# Altium schematic sheet mx8m_power.SchDoc
size A2; SheetNumber: 4; SheetTotal: 15
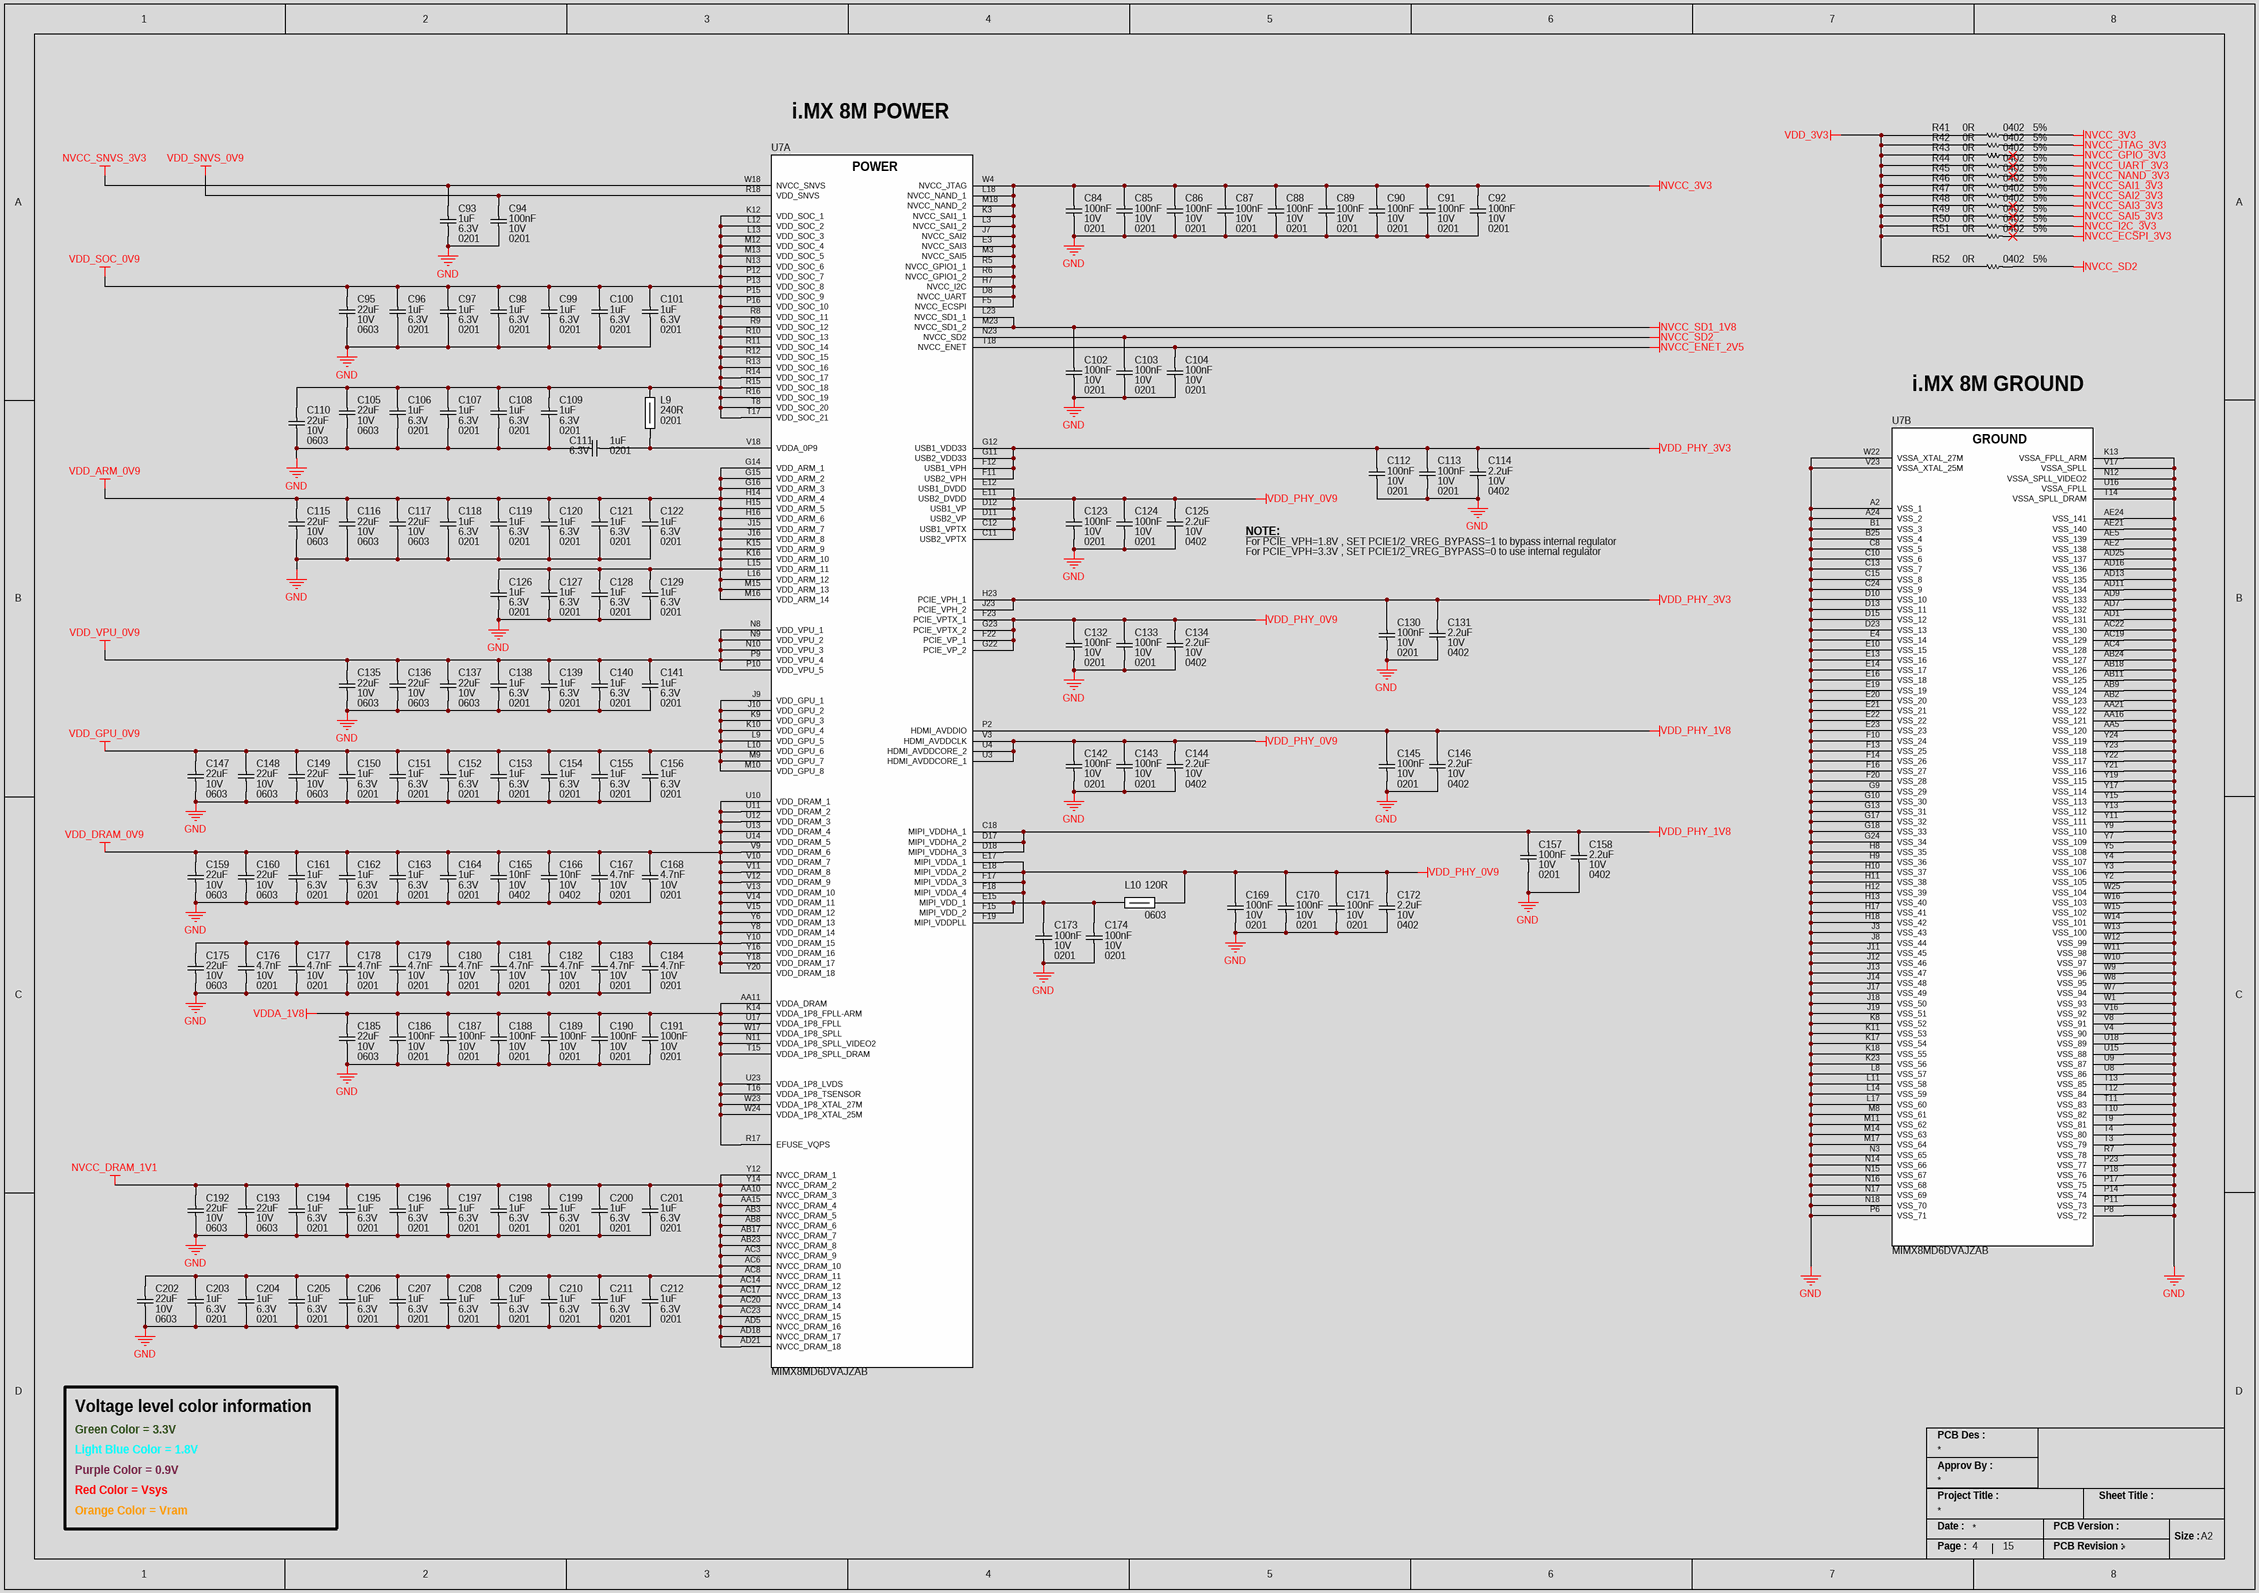
[diagram p0: mx8m_power.SchDoc]

## Parts
C84  Capacitance: 100nF  Voltage Rating: 10V  Case/Package: 0201  [CAP_0201_CAPC0603X03N]  (hidden comment: 0201X104K100CT)
C85  Capacitance: 100nF  Voltage Rating: 10V  Case/Package: 0201  [CAP_0201_CAPC0603X03N]  (hidden comment: 0201X104K100CT)
C86  Capacitance: 100nF  Voltage Rating: 10V  Case/Package: 0201  [CAP_0201_CAPC0603X03N]  (hidden comment: 0201X104K100CT)
C87  Capacitance: 100nF  Voltage Rating: 10V  Case/Package: 0201  [CAP_0201_CAPC0603X03N]  (hidden comment: 0201X104K100CT)
C88  Capacitance: 100nF  Voltage Rating: 10V  Case/Package: 0201  [CAP_0201_CAPC0603X03N]  (hidden comment: 0201X104K100CT)
C89  Capacitance: 100nF  Voltage Rating: 10V  Case/Package: 0201  [CAP_0201_CAPC0603X03N]  (hidden comment: 0201X104K100CT)
C90  Capacitance: 100nF  Voltage Rating: 10V  Case/Package: 0201  [CAP_0201_CAPC0603X03N]  (hidden comment: 0201X104K100CT)
C91  Capacitance: 100nF  Voltage Rating: 10V  Case/Package: 0201  [CAP_0201_CAPC0603X03N]  (hidden comment: 0201X104K100CT)
C92  Capacitance: 100nF  Voltage Rating: 10V  Case/Package: 0201  [CAP_0201_CAPC0603X03N]  (hidden comment: 0201X104K100CT)
C93  Voltage Rating (DC): 6.3V  Capacitance: 1uF  Case/Package: 0201  [CAP_0201_CAPC0603X03N]  (hidden comment: 02016D105MAT2A)
C94  Capacitance: 100nF  Voltage Rating: 10V  Case/Package: 0201  [CAP_0201_CAPC0603X03N]  (hidden comment: 0201X104K100CT)
C95  Capacitance: 22uF  Voltage Rating: 10V  Case Code (Imperial): 0603  [CAP_0603_CAPC1608X08N]  (hidden comment: C1608X5R1A226M080AC)
C96  Voltage Rating (DC): 6.3V  Capacitance: 1uF  Case/Package: 0201  [CAP_0201_CAPC0603X03N]  (hidden comment: 02016D105MAT2A)
C97  Voltage Rating (DC): 6.3V  Capacitance: 1uF  Case/Package: 0201  [CAP_0201_CAPC0603X03N]  (hidden comment: 02016D105MAT2A)
C98  Voltage Rating (DC): 6.3V  Capacitance: 1uF  Case/Package: 0201  [CAP_0201_CAPC0603X03N]  (hidden comment: 02016D105MAT2A)
C99  Voltage Rating (DC): 6.3V  Capacitance: 1uF  Case/Package: 0201  [CAP_0201_CAPC0603X03N]  (hidden comment: 02016D105MAT2A)
C100  Voltage Rating (DC): 6.3V  Capacitance: 1uF  Case/Package: 0201  [CAP_0201_CAPC0603X03N]  (hidden comment: 02016D105MAT2A)
C101  Voltage Rating (DC): 6.3V  Capacitance: 1uF  Case/Package: 0201  [CAP_0201_CAPC0603X03N]  (hidden comment: 02016D105MAT2A)
C102  Capacitance: 100nF  Voltage Rating: 10V  Case/Package: 0201  [CAP_0201_CAPC0603X03N]  (hidden comment: 0201X104K100CT)
C103  Capacitance: 100nF  Voltage Rating: 10V  Case/Package: 0201  [CAP_0201_CAPC0603X03N]  (hidden comment: 0201X104K100CT)
C104  Capacitance: 100nF  Voltage Rating: 10V  Case/Package: 0201  [CAP_0201_CAPC0603X03N]  (hidden comment: 0201X104K100CT)
C105  Capacitance: 22uF  Voltage Rating: 10V  Case Code (Imperial): 0603  [CAP_0603_CAPC1608X08N]  (hidden comment: C1608X5R1A226M080AC)
C106  Voltage Rating (DC): 6.3V  Capacitance: 1uF  Case/Package: 0201  [CAP_0201_CAPC0603X03N]  (hidden comment: 02016D105MAT2A)
C107  Voltage Rating (DC): 6.3V  Capacitance: 1uF  Case/Package: 0201  [CAP_0201_CAPC0603X03N]  (hidden comment: 02016D105MAT2A)
C108  Voltage Rating (DC): 6.3V  Capacitance: 1uF  Case/Package: 0201  [CAP_0201_CAPC0603X03N]  (hidden comment: 02016D105MAT2A)
C109  Voltage Rating (DC): 6.3V  Capacitance: 1uF  Case/Package: 0201  [CAP_0201_CAPC0603X03N]  (hidden comment: 02016D105MAT2A)
C110  Capacitance: 22uF  Voltage Rating: 10V  Case Code (Imperial): 0603  [CAP_0603_CAPC1608X08N]  (hidden comment: C1608X5R1A226M080AC)
C111  Voltage Rating (DC): 6.3V  Capacitance: 1uF  Case/Package: 0201  [CAP_0201_CAPC0603X03N]  (hidden comment: 02016D105MAT2A)
C112  Capacitance: 100nF  Voltage Rating: 10V  Case/Package: 0201  [CAP_0201_CAPC0603X03N]  (hidden comment: 0201X104K100CT)
C113  Capacitance: 100nF  Voltage Rating: 10V  Case/Package: 0201  [CAP_0201_CAPC0603X03N]  (hidden comment: 0201X104K100CT)
C114  Voltage Rating (DC): 10V  Capacitance: 2.2uF  Case/Package: 0402  [CAP_0201_CAPC0603X03N]  (hidden comment: C1005X5R1A225K050BC)
C115  Capacitance: 22uF  Voltage Rating: 10V  Case Code (Imperial): 0603  [CAP_0603_CAPC1608X08N]  (hidden comment: C1608X5R1A226M080AC)
C116  Capacitance: 22uF  Voltage Rating: 10V  Case Code (Imperial): 0603  [CAP_0603_CAPC1608X08N]  (hidden comment: C1608X5R1A226M080AC)
C117  Capacitance: 22uF  Voltage Rating: 10V  Case Code (Imperial): 0603  [CAP_0603_CAPC1608X08N]  (hidden comment: C1608X5R1A226M080AC)
C118  Voltage Rating (DC): 6.3V  Capacitance: 1uF  Case/Package: 0201  [CAP_0201_CAPC0603X03N]  (hidden comment: 02016D105MAT2A)
C119  Voltage Rating (DC): 6.3V  Capacitance: 1uF  Case/Package: 0201  [CAP_0201_CAPC0603X03N]  (hidden comment: 02016D105MAT2A)
C120  Voltage Rating (DC): 6.3V  Capacitance: 1uF  Case/Package: 0201  [CAP_0201_CAPC0603X03N]  (hidden comment: 02016D105MAT2A)
C121  Voltage Rating (DC): 6.3V  Capacitance: 1uF  Case/Package: 0201  [CAP_0201_CAPC0603X03N]  (hidden comment: 02016D105MAT2A)
C122  Voltage Rating (DC): 6.3V  Capacitance: 1uF  Case/Package: 0201  [CAP_0201_CAPC0603X03N]  (hidden comment: 02016D105MAT2A)
C123  Capacitance: 100nF  Voltage Rating: 10V  Case/Package: 0201  [CAP_0201_CAPC0603X03N]  (hidden comment: 0201X104K100CT)
C124  Capacitance: 100nF  Voltage Rating: 10V  Case/Package: 0201  [CAP_0201_CAPC0603X03N]  (hidden comment: 0201X104K100CT)
C125  Voltage Rating (DC): 10V  Capacitance: 2.2uF  Case/Package: 0402  [CAP_0201_CAPC0603X03N]  (hidden comment: C1005X5R1A225K050BC)
C126  Voltage Rating (DC): 6.3V  Capacitance: 1uF  Case/Package: 0201  [CAP_0201_CAPC0603X03N]  (hidden comment: 02016D105MAT2A)
C127  Voltage Rating (DC): 6.3V  Capacitance: 1uF  Case/Package: 0201  [CAP_0201_CAPC0603X03N]  (hidden comment: 02016D105MAT2A)
C128  Voltage Rating (DC): 6.3V  Capacitance: 1uF  Case/Package: 0201  [CAP_0201_CAPC0603X03N]  (hidden comment: 02016D105MAT2A)
C129  Voltage Rating (DC): 6.3V  Capacitance: 1uF  Case/Package: 0201  [CAP_0201_CAPC0603X03N]  (hidden comment: 02016D105MAT2A)
C130  Capacitance: 100nF  Voltage Rating: 10V  Case/Package: 0201  [CAP_0201_CAPC0603X03N]  (hidden comment: 0201X104K100CT)
C131  Voltage Rating (DC): 10V  Capacitance: 2.2uF  Case/Package: 0402  [CAP_0201_CAPC0603X03N]  (hidden comment: C1005X5R1A225K050BC)
C132  Capacitance: 100nF  Voltage Rating: 10V  Case/Package: 0201  [CAP_0201_CAPC0603X03N]  (hidden comment: 0201X104K100CT)
C133  Capacitance: 100nF  Voltage Rating: 10V  Case/Package: 0201  [CAP_0201_CAPC0603X03N]  (hidden comment: 0201X104K100CT)
C134  Voltage Rating (DC): 10V  Capacitance: 2.2uF  Case/Package: 0402  [CAP_0201_CAPC0603X03N]  (hidden comment: C1005X5R1A225K050BC)
C135  Capacitance: 22uF  Voltage Rating: 10V  Case Code (Imperial): 0603  [CAP_0603_CAPC1608X08N]  (hidden comment: C1608X5R1A226M080AC)
C136  Capacitance: 22uF  Voltage Rating: 10V  Case Code (Imperial): 0603  [CAP_0603_CAPC1608X08N]  (hidden comment: C1608X5R1A226M080AC)
C137  Capacitance: 22uF  Voltage Rating: 10V  Case Code (Imperial): 0603  [CAP_0603_CAPC1608X08N]  (hidden comment: C1608X5R1A226M080AC)
C138  Voltage Rating (DC): 6.3V  Capacitance: 1uF  Case/Package: 0201  [CAP_0201_CAPC0603X03N]  (hidden comment: 02016D105MAT2A)
C139  Voltage Rating (DC): 6.3V  Capacitance: 1uF  Case/Package: 0201  [CAP_0201_CAPC0603X03N]  (hidden comment: 02016D105MAT2A)
C140  Voltage Rating (DC): 6.3V  Capacitance: 1uF  Case/Package: 0201  [CAP_0201_CAPC0603X03N]  (hidden comment: 02016D105MAT2A)
C141  Voltage Rating (DC): 6.3V  Capacitance: 1uF  Case/Package: 0201  [CAP_0201_CAPC0603X03N]  (hidden comment: 02016D105MAT2A)
C142  Capacitance: 100nF  Voltage Rating: 10V  Case/Package: 0201  [CAP_0201_CAPC0603X03N]  (hidden comment: 0201X104K100CT)
C143  Capacitance: 100nF  Voltage Rating: 10V  Case/Package: 0201  [CAP_0201_CAPC0603X03N]  (hidden comment: 0201X104K100CT)
C144  Voltage Rating (DC): 10V  Capacitance: 2.2uF  Case/Package: 0402  [CAP_0201_CAPC0603X03N]  (hidden comment: C1005X5R1A225K050BC)
C145  Capacitance: 100nF  Voltage Rating: 10V  Case/Package: 0201  [CAP_0201_CAPC0603X03N]  (hidden comment: 0201X104K100CT)
C146  Voltage Rating (DC): 10V  Capacitance: 2.2uF  Case/Package: 0402  [CAP_0201_CAPC0603X03N]  (hidden comment: C1005X5R1A225K050BC)
C147  Capacitance: 22uF  Voltage Rating: 10V  Case Code (Imperial): 0603  [CAP_0603_CAPC1608X08N]  (hidden comment: C1608X5R1A226M080AC)
C148  Capacitance: 22uF  Voltage Rating: 10V  Case Code (Imperial): 0603  [CAP_0603_CAPC1608X08N]  (hidden comment: C1608X5R1A226M080AC)
C149  Capacitance: 22uF  Voltage Rating: 10V  Case Code (Imperial): 0603  [CAP_0603_CAPC1608X08N]  (hidden comment: C1608X5R1A226M080AC)
C150  Voltage Rating (DC): 6.3V  Capacitance: 1uF  Case/Package: 0201  [CAP_0201_CAPC0603X03N]  (hidden comment: 02016D105MAT2A)
C151  Voltage Rating (DC): 6.3V  Capacitance: 1uF  Case/Package: 0201  [CAP_0201_CAPC0603X03N]  (hidden comment: 02016D105MAT2A)
C152  Voltage Rating (DC): 6.3V  Capacitance: 1uF  Case/Package: 0201  [CAP_0201_CAPC0603X03N]  (hidden comment: 02016D105MAT2A)
C153  Voltage Rating (DC): 6.3V  Capacitance: 1uF  Case/Package: 0201  [CAP_0201_CAPC0603X03N]  (hidden comment: 02016D105MAT2A)
C154  Voltage Rating (DC): 6.3V  Capacitance: 1uF  Case/Package: 0201  [CAP_0201_CAPC0603X03N]  (hidden comment: 02016D105MAT2A)
C155  Voltage Rating (DC): 6.3V  Capacitance: 1uF  Case/Package: 0201  [CAP_0201_CAPC0603X03N]  (hidden comment: 02016D105MAT2A)
C156  Voltage Rating (DC): 6.3V  Capacitance: 1uF  Case/Package: 0201  [CAP_0201_CAPC0603X03N]  (hidden comment: 02016D105MAT2A)
C157  Capacitance: 100nF  Voltage Rating: 10V  Case/Package: 0201  [CAP_0201_CAPC0603X03N]  (hidden comment: 0201X104K100CT)
C158  Voltage Rating (DC): 10V  Capacitance: 2.2uF  Case/Package: 0402  [CAP_0201_CAPC0603X03N]  (hidden comment: C1005X5R1A225K050BC)
C159  Capacitance: 22uF  Voltage Rating: 10V  Case Code (Imperial): 0603  [CAP_0603_CAPC1608X08N]  (hidden comment: C1608X5R1A226M080AC)
C160  Capacitance: 22uF  Voltage Rating: 10V  Case Code (Imperial): 0603  [CAP_0603_CAPC1608X08N]  (hidden comment: C1608X5R1A226M080AC)
C161  Voltage Rating (DC): 6.3V  Capacitance: 1uF  Case/Package: 0201  [CAP_0201_CAPC0603X03N]  (hidden comment: 02016D105MAT2A)
C162  Voltage Rating (DC): 6.3V  Capacitance: 1uF  Case/Package: 0201  [CAP_0201_CAPC0603X03N]  (hidden comment: 02016D105MAT2A)
C163  Voltage Rating (DC): 6.3V  Capacitance: 1uF  Case/Package: 0201  [CAP_0201_CAPC0603X03N]  (hidden comment: 02016D105MAT2A)
C164  Voltage Rating (DC): 6.3V  Capacitance: 1uF  Case/Package: 0201  [CAP_0201_CAPC0603X03N]  (hidden comment: 02016D105MAT2A)
C165  Case Code (Imperial): 0402  Voltage Rating: 10V  Capacitance: 10nF  [CAP_0402_CAPC1005X05N]  (hidden comment: C0402C103K8RACTU)
C166  Case Code (Imperial): 0402  Voltage Rating: 10V  Capacitance: 10nF  [CAP_0402_CAPC1005X05N]  (hidden comment: C0402C103K8RACTU)
C167  Voltage Rating: 10V  Capacitance: 4.7nF  Case/Package: 0201  [CAP_0201_CAPC0603X03N]  (hidden comment: GRM033R61A472KA01D)
C168  Voltage Rating: 10V  Capacitance: 4.7nF  Case/Package: 0201  [CAP_0201_CAPC0603X03N]  (hidden comment: GRM033R61A472KA01D)
C169  Capacitance: 100nF  Voltage Rating: 10V  Case/Package: 0201  [CAP_0201_CAPC0603X03N]  (hidden comment: 0201X104K100CT)
C170  Capacitance: 100nF  Voltage Rating: 10V  Case/Package: 0201  [CAP_0201_CAPC0603X03N]  (hidden comment: 0201X104K100CT)
C171  Capacitance: 100nF  Voltage Rating: 10V  Case/Package: 0201  [CAP_0201_CAPC0603X03N]  (hidden comment: 0201X104K100CT)
C172  Voltage Rating (DC): 10V  Capacitance: 2.2uF  Case/Package: 0402  [CAP_0201_CAPC0603X03N]  (hidden comment: C1005X5R1A225K050BC)
C173  Capacitance: 100nF  Voltage Rating: 10V  Case/Package: 0201  [CAP_0201_CAPC0603X03N]  (hidden comment: 0201X104K100CT)
C174  Capacitance: 100nF  Voltage Rating: 10V  Case/Package: 0201  [CAP_0201_CAPC0603X03N]  (hidden comment: 0201X104K100CT)
C175  Capacitance: 22uF  Voltage Rating: 10V  Case Code (Imperial): 0603  [CAP_0603_CAPC1608X08N]  (hidden comment: C1608X5R1A226M080AC)
C176  Voltage Rating: 10V  Capacitance: 4.7nF  Case/Package: 0201  [CAP_0201_CAPC0603X03N]  (hidden comment: GRM033R61A472KA01D)
C177  Voltage Rating: 10V  Capacitance: 4.7nF  Case/Package: 0201  [CAP_0201_CAPC0603X03N]  (hidden comment: GRM033R61A472KA01D)
C178  Voltage Rating: 10V  Capacitance: 4.7nF  Case/Package: 0201  [CAP_0201_CAPC0603X03N]  (hidden comment: GRM033R61A472KA01D)
C179  Voltage Rating: 10V  Capacitance: 4.7nF  Case/Package: 0201  [CAP_0201_CAPC0603X03N]  (hidden comment: GRM033R61A472KA01D)
C180  Voltage Rating: 10V  Capacitance: 4.7nF  Case/Package: 0201  [CAP_0201_CAPC0603X03N]  (hidden comment: GRM033R61A472KA01D)
C181  Voltage Rating: 10V  Capacitance: 4.7nF  Case/Package: 0201  [CAP_0201_CAPC0603X03N]  (hidden comment: GRM033R61A472KA01D)
C182  Voltage Rating: 10V  Capacitance: 4.7nF  Case/Package: 0201  [CAP_0201_CAPC0603X03N]  (hidden comment: GRM033R61A472KA01D)
C183  Voltage Rating: 10V  Capacitance: 4.7nF  Case/Package: 0201  [CAP_0201_CAPC0603X03N]  (hidden comment: GRM033R61A472KA01D)
C184  Voltage Rating: 10V  Capacitance: 4.7nF  Case/Package: 0201  [CAP_0201_CAPC0603X03N]  (hidden comment: GRM033R61A472KA01D)
C185  Capacitance: 22uF  Voltage Rating: 10V  Case Code (Imperial): 0603  [CAP_0603_CAPC1608X08N]  (hidden comment: C1608X5R1A226M080AC)
C186  Capacitance: 100nF  Voltage Rating: 10V  Case/Package: 0201  [CAP_0201_CAPC0603X03N]  (hidden comment: 0201X104K100CT)
C187  Capacitance: 100nF  Voltage Rating: 10V  Case/Package: 0201  [CAP_0201_CAPC0603X03N]  (hidden comment: 0201X104K100CT)
C188  Capacitance: 100nF  Voltage Rating: 10V  Case/Package: 0201  [CAP_0201_CAPC0603X03N]  (hidden comment: 0201X104K100CT)
C189  Capacitance: 100nF  Voltage Rating: 10V  Case/Package: 0201  [CAP_0201_CAPC0603X03N]  (hidden comment: 0201X104K100CT)
C190  Capacitance: 100nF  Voltage Rating: 10V  Case/Package: 0201  [CAP_0201_CAPC0603X03N]  (hidden comment: 0201X104K100CT)
C191  Capacitance: 100nF  Voltage Rating: 10V  Case/Package: 0201  [CAP_0201_CAPC0603X03N]  (hidden comment: 0201X104K100CT)
C192  Capacitance: 22uF  Voltage Rating: 10V  Case Code (Imperial): 0603  [CAP_0603_CAPC1608X08N]  (hidden comment: C1608X5R1A226M080AC)
C193  Capacitance: 22uF  Voltage Rating: 10V  Case Code (Imperial): 0603  [CAP_0603_CAPC1608X08N]  (hidden comment: C1608X5R1A226M080AC)
C194  Voltage Rating (DC): 6.3V  Capacitance: 1uF  Case/Package: 0201  [CAP_0201_CAPC0603X03N]  (hidden comment: 02016D105MAT2A)
C195  Voltage Rating (DC): 6.3V  Capacitance: 1uF  Case/Package: 0201  [CAP_0201_CAPC0603X03N]  (hidden comment: 02016D105MAT2A)
C196  Voltage Rating (DC): 6.3V  Capacitance: 1uF  Case/Package: 0201  [CAP_0201_CAPC0603X03N]  (hidden comment: 02016D105MAT2A)
C197  Voltage Rating (DC): 6.3V  Capacitance: 1uF  Case/Package: 0201  [CAP_0201_CAPC0603X03N]  (hidden comment: 02016D105MAT2A)
C198  Voltage Rating (DC): 6.3V  Capacitance: 1uF  Case/Package: 0201  [CAP_0201_CAPC0603X03N]  (hidden comment: 02016D105MAT2A)
C199  Voltage Rating (DC): 6.3V  Capacitance: 1uF  Case/Package: 0201  [CAP_0201_CAPC0603X03N]  (hidden comment: 02016D105MAT2A)
C200  Voltage Rating (DC): 6.3V  Capacitance: 1uF  Case/Package: 0201  [CAP_0201_CAPC0603X03N]  (hidden comment: 02016D105MAT2A)
C201  Voltage Rating (DC): 6.3V  Capacitance: 1uF  Case/Package: 0201  [CAP_0201_CAPC0603X03N]  (hidden comment: 02016D105MAT2A)
C202  Capacitance: 22uF  Voltage Rating: 10V  Case Code (Imperial): 0603  [CAP_0603_CAPC1608X08N]  (hidden comment: C1608X5R1A226M080AC)
C203  Voltage Rating (DC): 6.3V  Capacitance: 1uF  Case/Package: 0201  [CAP_0201_CAPC0603X03N]  (hidden comment: 02016D105MAT2A)
C204  Voltage Rating (DC): 6.3V  Capacitance: 1uF  Case/Package: 0201  [CAP_0201_CAPC0603X03N]  (hidden comment: 02016D105MAT2A)
C205  Voltage Rating (DC): 6.3V  Capacitance: 1uF  Case/Package: 0201  [CAP_0201_CAPC0603X03N]  (hidden comment: 02016D105MAT2A)
C206  Voltage Rating (DC): 6.3V  Capacitance: 1uF  Case/Package: 0201  [CAP_0201_CAPC0603X03N]  (hidden comment: 02016D105MAT2A)
C207  Voltage Rating (DC): 6.3V  Capacitance: 1uF  Case/Package: 0201  [CAP_0201_CAPC0603X03N]  (hidden comment: 02016D105MAT2A)
C208  Voltage Rating (DC): 6.3V  Capacitance: 1uF  Case/Package: 0201  [CAP_0201_CAPC0603X03N]  (hidden comment: 02016D105MAT2A)
C209  Voltage Rating (DC): 6.3V  Capacitance: 1uF  Case/Package: 0201  [CAP_0201_CAPC0603X03N]  (hidden comment: 02016D105MAT2A)
C210  Voltage Rating (DC): 6.3V  Capacitance: 1uF  Case/Package: 0201  [CAP_0201_CAPC0603X03N]  (hidden comment: 02016D105MAT2A)
C211  Voltage Rating (DC): 6.3V  Capacitance: 1uF  Case/Package: 0201  [CAP_0201_CAPC0603X03N]  (hidden comment: 02016D105MAT2A)
C212  Voltage Rating (DC): 6.3V  Capacitance: 1uF  Case/Package: 0201  [CAP_0201_CAPC0603X03N]  (hidden comment: 02016D105MAT2A)
L9  Impedance: 240R  Case/Package: 0201  [IND_0201_FERRITE_BEAD]  (hidden comment: BLM03AX241SN1D)
L10  Impedance: 120R  Case/Package: 0603  [IND_0603_INDC1608X08N]  (hidden comment: BLM18PG121SH1D)
R41  Case Code (Imperial): 0402  Tolerance: 5%  Resistance: 0R  [RES_0402_RESC1005X04N]  (hidden comment: ERJ-2GE0R00X)
R42  Case Code (Imperial): 0402  Tolerance: 5%  Resistance: 0R  [RES_0402_RESC1005X04N]  (hidden comment: ERJ-2GE0R00X)
R43  Case Code (Imperial): 0402  Tolerance: 5%  Resistance: 0R  [RES_0402_RESC1005X04N]  (hidden comment: ERJ-2GE0R00X)
R44  Case Code (Imperial): 0402  Tolerance: 5%  Resistance: 0R  [RES_0402_RESC1005X04N]  (hidden comment: ERJ-2GE0R00X)
R45  Case Code (Imperial): 0402  Tolerance: 5%  Resistance: 0R  [RES_0402_RESC1005X04N]  (hidden comment: ERJ-2GE0R00X)
R46  Case Code (Imperial): 0402  Tolerance: 5%  Resistance: 0R  [RES_0402_RESC1005X04N]  (hidden comment: ERJ-2GE0R00X)
R47  Case Code (Imperial): 0402  Tolerance: 5%  Resistance: 0R  [RES_0402_RESC1005X04N]  (hidden comment: ERJ-2GE0R00X)
R48  Case Code (Imperial): 0402  Tolerance: 5%  Resistance: 0R  [RES_0402_RESC1005X04N]  (hidden comment: ERJ-2GE0R00X)
R49  Case Code (Imperial): 0402  Tolerance: 5%  Resistance: 0R  [RES_0402_RESC1005X04N]  (hidden comment: ERJ-2GE0R00X)
R50  Case Code (Imperial): 0402  Tolerance: 5%  Resistance: 0R  [RES_0402_RESC1005X04N]  (hidden comment: ERJ-2GE0R00X)
R51  Case Code (Imperial): 0402  Tolerance: 5%  Resistance: 0R  [RES_0402_RESC1005X04N]  (hidden comment: ERJ-2GE0R00X)
R52  Case Code (Imperial): 0402  Tolerance: 5%  Resistance: 0R  [RES_0402_RESC1005X04N]  (hidden comment: ERJ-2GE0R00X)
U7  MIMX8MD6DVAJZAB  [IC_MPU_BGA621C65P25X25_1700X1700X218]  (parts A,B of 14)

## Nets
GND: C84.1 C85.1 C86.1 C87.1 C88.1 C89.1 C90.1 C91.1 C92.1 C93.1 C94.1 C95.1 C96.1 C97.1 C98.1 C99.1 C100.1 C101.1 C102.1 C103.1 C104.1 C105.1 C106.1 C107.1 C108.1 C109.1 C110.1 C111.2 C112.1 C113.1 C114.1 C115.1 C116.1 C117.1 C118.1 C119.1 C120.1 C121.1 C122.1 C123.1 C124.1 C125.1 C126.1 C127.1 C128.1 C129.1 C130.1 C131.1 C132.1 C133.1 C134.1 C135.1 C136.1 C137.1 C138.1 C139.1 C140.1 C141.1 C142.1 C143.1 C144.1 C145.1 C146.1 C147.1 C148.1 C149.1 C150.1 C151.1 C152.1 C153.1 C154.1 C155.1 C156.1 C157.1 C158.1 C159.1 C160.1 C161.1 C162.1 C163.1 C164.1 C165.1 C166.1 C167.1 C168.1 C169.1 C170.1 C171.1 C172.1 C173.1 C174.1 C175.1 C176.1 C177.1 C178.1 C179.1 C180.1 C181.1 C182.1 C183.1 C184.1 C185.1 C186.1 C187.1 C188.1 C189.1 C190.1 C191.1 C192.1 C193.1 C194.1 C195.1 C196.1 C197.1 C198.1 C199.1 C200.1 C201.1 C202.1 C203.1 C204.1 C205.1 C206.1 C207.1 C208.1 C209.1 C210.1 C211.1 C212.1 U7.A2(VSS_1) U7.A24(VSS_2) U7.AA5(VSS_120) U7.AA16(VSS_121) U7.AA21(VSS_122) U7.AB2(VSS_123) U7.AB9(VSS_124) U7.AB11(VSS_125) U7.AB18(VSS_126) U7.AB24(VSS_127) U7.AC4(VSS_128) U7.AC19(VSS_129) U7.AC22(VSS_130) U7.AD1(VSS_131) U7.AD7(VSS_132) U7.AD9(VSS_133) U7.AD11(VSS_134) U7.AD13(VSS_135) U7.AD16(VSS_136) U7.AD25(VSS_137) U7.AE2(VSS_138) U7.AE5(VSS_139) U7.AE21(VSS_140) U7.AE24(VSS_141) U7.B1(VSS_3) U7.B25(VSS_4) U7.C8(VSS_5) U7.C10(VSS_6) U7.C13(VSS_7) U7.C15(VSS_8) U7.C24(VSS_9) U7.D10(VSS_10) U7.D13(VSS_11) U7.D15(VSS_12) U7.D23(VSS_13) U7.E4(VSS_14) U7.E10(VSS_15) U7.E13(VSS_16) U7.E14(VSS_17) U7.E16(VSS_18) U7.E19(VSS_19) U7.E20(VSS_20) U7.E21(VSS_21) U7.E22(VSS_22) U7.E23(VSS_23) U7.F10(VSS_24) U7.F13(VSS_25) U7.F14(VSS_26) U7.F16(VSS_27) U7.F20(VSS_28) U7.G9(VSS_29) U7.G10(VSS_30) U7.G13(VSS_31) U7.G17(VSS_32) U7.G18(VSS_33) U7.G24(VSS_34) U7.H8(VSS_35) U7.H9(VSS_36) U7.H10(VSS_37) U7.H11(VSS_38) U7.H12(VSS_39) U7.H13(VSS_40) U7.H17(VSS_41) U7.H18(VSS_42) U7.J3(VSS_43) U7.J8(VSS_44) U7.J11(VSS_45) U7.J12(VSS_46) U7.J13(VSS_47) U7.J14(VSS_48) U7.J17(VSS_49) U7.J18(VSS_50) U7.J19(VSS_51) U7.K8(VSS_52) U7.K11(VSS_53) U7.K13(VSSA_FPLL_ARM) U7.K17(VSS_54) U7.K18(VSS_55) U7.K23(VSS_56) U7.L8(VSS_57) U7.L11(VSS_58) U7.L14(VSS_59) U7.L17(VSS_60) U7.M8(VSS_61) U7.M11(VSS_62) U7.M14(VSS_63) U7.M17(VSS_64) U7.N3(VSS_65) U7.N12(VSSA_SPLL_VIDEO2) U7.N14(VSS_66) U7.N15(VSS_67) U7.N16(VSS_68) U7.N17(VSS_69) U7.N18(VSS_70) U7.P6(VSS_71) U7.P8(VSS_72) U7.P11(VSS_73) U7.P14(VSS_74) U7.P17(VSS_75) U7.P18(VSS_76) U7.P23(VSS_77) U7.R7(VSS_78) U7.T3(VSS_79) U7.T4(VSS_80) U7.T9(VSS_81) U7.T10(VSS_82) U7.T11(VSS_83) U7.T12(VSS_84) U7.T13(VSS_85) U7.T14(VSSA_SPLL_DRAM) U7.U8(VSS_86) U7.U9(VSS_87) U7.U15(VSS_88) U7.U16(VSSA_FPLL) U7.U18(VSS_89) U7.V4(VSS_90) U7.V8(VSS_91) U7.V16(VSS_92) U7.V17(VSSA_SPLL) U7.V23(VSSA_XTAL_25M) U7.W1(VSS_93) U7.W7(VSS_94) U7.W8(VSS_95) U7.W9(VSS_96) U7.W10(VSS_97) U7.W11(VSS_98) U7.W12(VSS_99) U7.W13(VSS_100) U7.W14(VSS_101) U7.W15(VSS_102) U7.W16(VSS_103) U7.W22(VSSA_XTAL_27M) U7.W25(VSS_104) U7.Y2(VSS_105) U7.Y3(VSS_106) U7.Y4(VSS_107) U7.Y5(VSS_108) U7.Y7(VSS_109) U7.Y9(VSS_110) U7.Y11(VSS_111) U7.Y13(VSS_112) U7.Y15(VSS_113) U7.Y17(VSS_114) U7.Y19(VSS_115) U7.Y21(VSS_116) U7.Y22(VSS_117) U7.Y23(VSS_118) U7.Y24(VSS_119)
NVCC_3V3: C84.2 C85.2 C86.2 C87.2 C88.2 C89.2 C90.2 C91.2 C92.2 R41.2 U7.D8(NVCC_UART) U7.E3(NVCC_SAI3) U7.F5(NVCC_ECSPI) U7.H7(NVCC_I2C) U7.J7(NVCC_SAI2) U7.K3(NVCC_SAI1_1) U7.L3(NVCC_SAI1_2) U7.L18(NVCC_NAND_1) U7.M3(NVCC_SAI5) U7.M18(NVCC_NAND_2) U7.R5(NVCC_GPIO1_1) U7.R6(NVCC_GPIO1_2) U7.W4(NVCC_JTAG)
NVCC_DRAM_1V1: C192.2 C193.2 C194.2 C195.2 C196.2 C197.2 C198.2 C199.2 C200.2 C201.2 C202.2 C203.2 C204.2 C205.2 C206.2 C207.2 C208.2 C209.2 C210.2 C211.2 C212.2 U7.AA10(NVCC_DRAM_3) U7.AA15(NVCC_DRAM_4) U7.AB3(NVCC_DRAM_5) U7.AB8(NVCC_DRAM_6) U7.AB17(NVCC_DRAM_7) U7.AB23(NVCC_DRAM_8) U7.AC3(NVCC_DRAM_9) U7.AC6(NVCC_DRAM_10) U7.AC8(NVCC_DRAM_11) U7.AC14(NVCC_DRAM_12) U7.AC17(NVCC_DRAM_13) U7.AC20(NVCC_DRAM_14) U7.AC23(NVCC_DRAM_15) U7.AD5(NVCC_DRAM_16) U7.AD18(NVCC_DRAM_17) U7.AD21(NVCC_DRAM_18) U7.Y12(NVCC_DRAM_1) U7.Y14(NVCC_DRAM_2)
NVCC_ECSPI_3V3: R51.2
NVCC_ENET_2V5: C104.2 U7.T18(NVCC_ENET)
NVCC_GPIO_3V3: R43.2
NVCC_I2C_3V3: R50.2
NVCC_JTAG_3V3: R42.2
NVCC_NAND_3V3: R45.2
NVCC_SAI1_3V3: R46.2
NVCC_SAI2_3V3: R47.2
NVCC_SAI3_3V3: R48.2
NVCC_SAI5_3V3: R49.2
NVCC_SD1_1V8: C102.2 U7.L23(NVCC_SD1_1) U7.M23(NVCC_SD1_2)
NVCC_SD2: C103.2 R52.2 U7.N23(NVCC_SD2)
NVCC_SNVS_3V3: C93.2 U7.W18(NVCC_SNVS)
NVCC_UART_3V3: R44.2
VDD_3V3: R41.1 R42.1 R43.1 R44.1 R45.1 R46.1 R47.1 R48.1 R49.1 R50.1 R51.1 R52.1
VDD_ARM_0V9: C115.2 C116.2 C117.2 C118.2 C119.2 C120.2 C121.2 C122.2 C126.2 C127.2 C128.2 C129.2 U7.G14(VDD_ARM_1) U7.G15(VDD_ARM_2) U7.G16(VDD_ARM_3) U7.H14(VDD_ARM_4) U7.H15(VDD_ARM_5) U7.H16(VDD_ARM_6) U7.J15(VDD_ARM_7) U7.J16(VDD_ARM_8) U7.K15(VDD_ARM_9) U7.K16(VDD_ARM_10) U7.L15(VDD_ARM_11) U7.L16(VDD_ARM_12) U7.M15(VDD_ARM_13) U7.M16(VDD_ARM_14)
VDD_DRAM_0V9: C159.2 C160.2 C161.2 C162.2 C163.2 C164.2 C165.2 C166.2 C167.2 C168.2 C175.2 C176.2 C177.2 C178.2 C179.2 C180.2 C181.2 C182.2 C183.2 C184.2 U7.U10(VDD_DRAM_1) U7.U11(VDD_DRAM_2) U7.U12(VDD_DRAM_3) U7.U13(VDD_DRAM_4) U7.U14(VDD_DRAM_5) U7.V9(VDD_DRAM_6) U7.V10(VDD_DRAM_7) U7.V11(VDD_DRAM_8) U7.V12(VDD_DRAM_9) U7.V13(VDD_DRAM_10) U7.V14(VDD_DRAM_11) U7.V15(VDD_DRAM_12) U7.Y6(VDD_DRAM_13) U7.Y8(VDD_DRAM_14) U7.Y10(VDD_DRAM_15) U7.Y16(VDD_DRAM_16) U7.Y18(VDD_DRAM_17) U7.Y20(VDD_DRAM_18)
VDD_GPU_0V9: C147.2 C148.2 C149.2 C150.2 C151.2 C152.2 C153.2 C154.2 C155.2 C156.2 U7.J9(VDD_GPU_1) U7.J10(VDD_GPU_2) U7.K9(VDD_GPU_3) U7.K10(VDD_GPU_4) U7.L9(VDD_GPU_5) U7.L10(VDD_GPU_6) U7.M9(VDD_GPU_7) U7.M10(VDD_GPU_8)
VDD_PHY_0V9: C123.2 C124.2 C125.2 C132.2 C133.2 C134.2 C142.2 C143.2 C144.2 C169.2 C170.2 C171.2 C172.2 L10.2 U7.C11(USB2_VPTX) U7.C12(USB1_VPTX) U7.D11(USB2_VP) U7.D12(USB1_VP) U7.E11(USB2_DVDD) U7.E12(USB1_DVDD) U7.E17(MIPI_VDDA_1) U7.E18(MIPI_VDDA_2) U7.F17(MIPI_VDDA_3) U7.F18(MIPI_VDDA_4) U7.F19(MIPI_VDDPLL) U7.F22(PCIE_VP_1) U7.F23(PCIE_VPTX_1) U7.G22(PCIE_VP_2) U7.G23(PCIE_VPTX_2) U7.U3(HDMI_AVDDCORE_1) U7.U4(HDMI_AVDDCORE_2) U7.V3(HDMI_AVDDCLK)
VDD_PHY_1V8: C145.2 C146.2 C157.2 C158.2 U7.C18(MIPI_VDDHA_1) U7.D17(MIPI_VDDHA_2) U7.D18(MIPI_VDDHA_3) U7.P2(HDMI_AVDDIO)
VDD_PHY_3V3: C112.2 C113.2 C114.2 C130.2 C131.2 U7.F11(USB2_VPH) U7.F12(USB1_VPH) U7.G11(USB2_VDD33) U7.G12(USB1_VDD33) U7.H23(PCIE_VPH_1) U7.J23(PCIE_VPH_2)
VDD_SNVS_0V9: C94.2 U7.R18(VDD_SNVS)
VDD_SOC_0V9: C95.2 C96.2 C97.2 C98.2 C99.2 C100.2 C101.2 C105.2 C106.2 C107.2 C108.2 C109.2 C110.2 L9.2 U7.K12(VDD_SOC_1) U7.L12(VDD_SOC_2) U7.L13(VDD_SOC_3) U7.M12(VDD_SOC_4) U7.M13(VDD_SOC_5) U7.N13(VDD_SOC_6) U7.P12(VDD_SOC_7) U7.P13(VDD_SOC_8) U7.P15(VDD_SOC_9) U7.P16(VDD_SOC_10) U7.R8(VDD_SOC_11) U7.R9(VDD_SOC_12) U7.R10(VDD_SOC_13) U7.R11(VDD_SOC_14) U7.R12(VDD_SOC_15) U7.R13(VDD_SOC_16) U7.R14(VDD_SOC_17) U7.R15(VDD_SOC_18) U7.R16(VDD_SOC_19) U7.T8(VDD_SOC_20) U7.T17(VDD_SOC_21)
VDD_VPU_0V9: C135.2 C136.2 C137.2 C138.2 C139.2 C140.2 C141.2 U7.N8(VDD_VPU_1) U7.N9(VDD_VPU_2) U7.N10(VDD_VPU_3) U7.P9(VDD_VPU_4) U7.P10(VDD_VPU_5)
VDDA_1V8: C185.2 C186.2 C187.2 C188.2 C189.2 C190.2 C191.2 U7.AA11(VDDA_DRAM) U7.K14(VDDA_1P8_FPLL-ARM) U7.N11(VDDA_1P8_SPLL_VIDEO2) U7.R17(EFUSE_VQPS) U7.T15(VDDA_1P8_SPLL_DRAM) U7.T16(VDDA_1P8_TSENSOR) U7.U17(VDDA_1P8_FPLL) U7.U23(VDDA_1P8_LVDS) U7.W17(VDDA_1P8_SPLL) U7.W23(VDDA_1P8_XTAL_27M) U7.W24(VDDA_1P8_XTAL_25M)
NetC111_1: C111.1 L9.1 U7.V18(VDDA_0P9)
NetC173_2: C173.2 C174.2 L10.1 U7.E15(MIPI_VDD_1) U7.F15(MIPI_VDD_2)

## Notes on the sheet
- i.MX 8M POWER
- i.MX 8M GROUND
- NOTE:
- For PCIE_VPH=1.8V , SET PCIE1/2_VREG_BYPASS=1 to bypass internal regulator
- For PCIE_VPH=3.3V , SET PCIE1/2_VREG_BYPASS=0 to use internal regulator
- Voltage level color information
- Green Color = 3.3V
- Light Blue Color = 1.8V
- Purple Color = 0.9V
- Red Color = Vsys
- Orange Color = Vram
- PCB Des :
- Approv By :
- Project Title :
- Sheet Title :
- Date :
- Page :
- PCB Version :
- PCB Revision :
- Size :
- A2
- (in symbol IC_MPU_ARM_1.5GHZ_MIMX8MD6DVAJZAB, part A) POWER
- (in symbol IC_MPU_ARM_1.5GHZ_MIMX8MD6DVAJZAB, part B) GROUND

## Library data of the parts
C84-C92 C94 C102-C104 C112 C113 C123 C124 C130 C132 C133 C142 C143 C145 C157 C169-C171 C173 C174 C186-C191 = CAP_0.1UF_10V_X5R_0201: 0201 0.1 uF 10 V ±10 %Tolerance X5R Surface Mount Multilayer Ceramic Capacitor; Manufacturer: Walsin Technologies; Tolerance: 10%; Dielectric: 1537DielectricType; Supplier 1: Digi-Key; Manufacturer Part Number: 0201X104K100CT; RoHS: Yes; Category: Ceramic Capacitors; Stock 1: 1142023; Pricing 1: 1=0.1, 10=0.028, 50=0.0164, 100=0.0127, 500=0.00954, 1000=0.0075, 2500=0.00682, 5000=0.00627 (USD); Mount: Surface Mount; Case Code (Imperial): 0201; Case Code (Metric): 0603; Min Operating Temperature: -55°C; Max Operating Temperature: 85°C; Packaging: Cut Tape; Series: -; Voltage Rating (DC): 10V; RoHS Compliant: Yes; Lead Free: 5697LeadFree; ComponentLink1URL: http://www.passivecomponent.com/indexsea/0201X104K100CT-IL.pdf?src-supplier=Digi-Key; ComponentLink1Description: http://www.passivecomponent.com/indexsea/0201X104K100CT-IL.pdf?src-supplier=Digi-Key; ComponentLink2URL: http://www.passivecomponent.com/wp-content/uploads/2018/10/MLCC.pdf?src-supplier=Digi-Key; ComponentLink2Description: http://www.passivecomponent.com/wp-content/uploads/2018/10/MLCC.pdf?src-supplier=Digi-Key; ComponentLink3URL: http://datasheet.octopart.com/0201X104K100CT-Walsin-Technologies-datasheet-136037192.pdf?src-supplier=Rs; ComponentLink3Description: http://datasheet.octopart.com/0201X104K100CT-Walsin-Technologies-datasheet-136037192.pdf?src-supplier=Rs; Supplier Part Number 1: 1292-1160-6-ND
C93 C96-C101 C106-C109 C111 C118-C122 C126-C129 C138-C141 C150-C156 C161-C164 C194-C201 C203-C212 = CAP_1UF_6.3V_X5R_0201: 0201 1 uF 6.3 V ±20 % Tolerance X5R Surface Mount Multilayer Ceramic Capacitor; Manufacturer: Kyocera AVX; Tolerance: 20%; Supplier 1: Mouser; Manufacturer Part Number: 02016D105MAT2A; RoHS: Yes; Category: Ceramic Capacitors; Stock 1: 1026413; Pricing 1: 1=0.1, 10=0.028, 50=0.028, 100=0.014, 1000=0.008, 10000=0.006 (USD); Mount: Surface Mount; Number of Pins: 2; Case Code (Metric): 0603; Case Code (Imperial): 0201; Min Operating Temperature: -55°C; Max Operating Temperature: 85°C; Packaging: Cut Tape; Series: -; Voltage Rating: 6.3V; Package Quantity: 1; Length: 0.024inch; Width: 0.012inch; Thickness: 0.013inch; Depth: 0.3mm; Lead Free: Lead Free; RoHS Compliant: Yes; Reach SVHC Compliant: No; ComponentLink1URL: https://datasheet.ciiva.com/6265/cx5r-6265595.pdf?src-supplier=Digi-Key; ComponentLink1Description: https://datasheet.ciiva.com/6265/cx5r-6265595.pdf?src-supplier=Digi-Key; ComponentLink2URL: https://datasheet.ciiva.com/1123/1666675-1123122.pdf?src-supplier=Element14; ComponentLink2Description: https://datasheet.ciiva.com/1123/1666675-1123122.pdf?src-supplier=Element14; ComponentLink3URL: https://datasheet.ciiva.com/14891/cx5r-14891029.pdf?src-supplier=Digi-Key; ComponentLink3Description: https://datasheet.ciiva.com/14891/cx5r-14891029.pdf?src-supplier=Digi-Key; ComponentLink4URL: https://datasheet.ciiva.com/7614/cx5r-7614682.pdf?src-supplier=Digi-Key; ComponentLink4Description: https://datasheet.ciiva.com/7614/cx5r-7614682.pdf?src-supplier=Digi-Key; ComponentLink5URL: https://datasheet.ciiva.com/14891/cx5r-14891030.pdf?src-supplier=Digi-Key; ComponentLink5Description: https://datasheet.ciiva.com/14891/cx5r-14891030.pdf?src-supplier=Digi-Key; Supplier Part Number 1: 581-02016D105MAT2A; Dielectric: X5R
C95 C105 C110 C115-C117 C135-C137 C147-C149 C159 C160 C175 C185 C192 C193 C202 = CAP_22UF_10V_X5R_0603: Multilayer Ceramic Capacitor, 22 uF, 10 V, ± 20%, X5R, 0603 [1608 Metric]; Manufacturer: TDK; Supplier 1: Digi-Key; Manufacturer Part Number: C1608X5R1A226M080AC; RoHS: Yes; Category: Ceramic Capacitors; Stock 1: 1971709; Pricing 1: 1=0.32, 10=0.208, 50=0.1534, 100=0.1248, 500=0.09856, 1000=0.08323 (USD); Mount: Surface Mount; Case/Package: 0603; Case Code (Metric): 1608; Dielectric Material: Ceramic; Weight: 7.1E-05oz; Min Operating Temperature: -55°C; Max Operating Temperature: 85°C; Tolerance: 20%; Packaging: Tape and Reel; Voltage Rating (DC): 10V; Termination: SMD/SMT; Series: C; Package Quantity: 4000; Dielectric: X5R; Length: 1.6mm; Width: 0.8mm; Height: 0.8mm; Reach SVHC Compliant: No; Lead Free: Lead Free; RoHS Compliant: Yes; ComponentLink1URL: https://datasheet.ciiva.com/6274/tdkmlcccaprange-6274860.pdf?src-supplier=Digi-Key; ComponentLink1Description: https://datasheet.ciiva.com/6274/tdkmlcccaprange-6274860.pdf?src-supplier=Digi-Key; ComponentLink2URL: https://datasheet.ciiva.com/6274/tdkmlcccaprange-6274859.pdf?src-supplier=Digi-Key; ComponentLink2Description: https://datasheet.ciiva.com/6274/tdkmlcccaprange-6274859.pdf?src-supplier=Digi-Key; ComponentLink3URL: https://datasheet.ciiva.com/6274/tdkmlcccaprange-6274861.pdf?src-supplier=Digi-Key; ComponentLink3Description: https://datasheet.ciiva.com/6274/tdkmlcccaprange-6274861.pdf?src-supplier=Digi-Key; ComponentLink4URL: https://datasheet.ciiva.com/24216/mlcc-commercial-general-en-24216575.pdf?src-supplier=Mouser; ComponentLink4Description: https://datasheet.ciiva.com/24216/mlcc-commercial-general-en-24216575.pdf?src-supplier=Mouser; Supplier Part Number 1: 445-9077-1-ND
C114 C125 C131 C134 C144 C146 C158 C172 = CAP_2.2UF_10V_X5R_0402: Multilayer Ceramic Capacitor, 2.2 uF, 10 V, ± 10%, X5R, 0402 [1005 Metric]; Manufacturer: TDK; Material: 4241ConductorMaterial; Supplier 1: Digi-Key; Manufacturer Part Number: C1005X5R1A225K050BC; RoHS: Yes; Category: Ceramic Capacitors; Stock 1: 748837; Pricing 1: 1=0.3, 10=0.196, 50=0.1376, 100=0.1111, 500=0.08256, 1000=0.07224, 2500=0.0688, 5000=0.06364 (USD); Mount: Surface Mount; Number of Pins: 2; Dielectric Material: Ceramic; Case Code (Metric): 1005; Case Code (Imperial): 0402; Weight: 2.3E-05oz; Min Operating Temperature: -55°C; Max Operating Temperature: 85°C; Tolerance: 10%; Dielectric: X5R; Packaging: Tape and Reel; Construction: Flat; Voltage Rating: 10V; Package Quantity: 10000; Termination: SMD/SMT; Voltage: 10V; Series: C; Length: 1mm; Width: 0.5mm; Height: 0.5mm; Depth: 0.5mm; Lead Free: Lead Free; RoHS Compliant: Yes; Reach SVHC Compliant: No; ComponentLink1URL: https://datasheet.ciiva.com/24216/c1005x5r1a225k050bc-264297-24216439.pdf?src-supplier=Mouser; ComponentLink1Description: https://datasheet.ciiva.com/24216/c1005x5r1a225k050bc-264297-24216439.pdf?src-supplier=Mouser; ComponentLink2URL: https://datasheet.ciiva.com/6289/tdkmlcccaprange-6289823.pdf?src-supplier=Digi-Key; ComponentLink2Description: https://datasheet.ciiva.com/6289/tdkmlcccaprange-6289823.pdf?src-supplier=Digi-Key; ComponentLink3URL: https://datasheet.ciiva.com/6289/tdkmlcccaprange-6289830.pdf?src-supplier=Digi-Key; ComponentLink3Description: https://datasheet.ciiva.com/6289/tdkmlcccaprange-6289830.pdf?src-supplier=Digi-Key; ComponentLink4URL: https://datasheet.ciiva.com/22719/1796654-22719527.pdf?src-supplier=Element14; ComponentLink4Description: https://datasheet.ciiva.com/22719/1796654-22719527.pdf?src-supplier=Element14; ComponentLink5URL: https://datasheet.ciiva.com/28451/1796654-28451002.pdf?src-supplier=Element14; ComponentLink5Description: https://datasheet.ciiva.com/28451/1796654-28451002.pdf?src-supplier=Element14; ComponentLink6URL: https://datasheet.ciiva.com/28665/mlcc-commercial-general-en-28665493.pdf?src-supplier=Element14; ComponentLink6Description: https://datasheet.ciiva.com/28665/mlcc-commercial-general-en-28665493.pdf?src-supplier=Element14; ComponentLink7URL: https://datasheet.ciiva.com/23802/1796654-23802731.pdf?src-supplier=Newark; ComponentLink7Description: https://datasheet.ciiva.com/23802/1796654-23802731.pdf?src-supplier=Newark; ComponentLink8URL: https://datasheet.ciiva.com/16425/general-b11-16425676.pdf?src-supplier=Future+Electronics; ComponentLink8Description: https://datasheet.ciiva.com/16425/general-b11-16425676.pdf?src-supplier=Future+Electronics; Supplier Part Number 1: 445-7392-1-ND
C165 C166 = CAP_10nF_10V_X7R_0402: Ceramic Capacitor, Multilayer, Ceramic, 10V, 10% +Tol, 10% -Tol, X7R, 15% TC, 0.01uF, 0402; Manufacturer: KEMET; Dielectric Material: 4241ConductorMaterial; Dissipation Factor: 5%; Supplier 1: Digikey; Manufacturer Part Number: C0402C103K8RACTU; RoHS: Yes; Category: Ceramic Capacitors; Stock 1: 703450; Pricing 1: 1=0.1, 10=0.018, 50=0.0104, 100=0.008, 500=0.006, 1000=0.00472, 2500=0.00429, 5000=0.00395 (USD); Mount: Surface Mount; Case/Package: 0402; Number of Pins: 2NUMBER; Case Code (Metric): 1005; Material: 4241ConductorMaterial; Min Operating Temperature: -55°C; Max Operating Temperature: 125°C; Tolerance: 10%; Dielectric: X7R; Package Quantity: 10000; Packaging: Tape and Reel; Voltage Rating (DC): 10V; Termination: SMD/SMT; Series: SMD Comm X7R; Construction: Flat; Length: 1mm; Width: 0.5mm; Height: 0.5mm; Lead Pitch: 0.3mm; Thickness: 0.022inch; Depth: 0.5mm; Radiation Hardening: No; RoHS Compliant: Yes; Reach SVHC Compliant: No; ComponentLink1URL: http://www.jameco.com/Jameco/Products/ProdDS/2014182.pdf?src-supplier=Jameco; ComponentLink1Description: http://www.jameco.com/Jameco/Products/ProdDS/2014182.pdf?src-supplier=Jameco; ComponentLink2URL: http://www.farnell.com/datasheets/2746035.pdf?src-supplier=Farnell; ComponentLink2Description: http://www.farnell.com/datasheets/2746035.pdf?src-supplier=Farnell; ComponentLink3URL: http://components.arrow.com/part/dataview/3443725S6046007N7429?src-supplier=Arrow+Electronics; ComponentLink3Description: http://components.arrow.com/part/dataview/3443725S6046007N7429?src-supplier=Arrow+Electronics; ComponentLink4URL: http://www.mouser.com/ds/2/212/KEM_C1002_X7R_SMD-1102033.pdf?src-supplier=Mouser; ComponentLink4Description: http://www.mouser.com/ds/2/212/KEM_C1002_X7R_SMD-1102033.pdf?src-supplier=Mouser; ComponentLink5URL: http://www.farnell.com/datasheets/1828800.pdf?src-supplier=Newark; ComponentLink5Description: http://www.farnell.com/datasheets/1828800.pdf?src-supplier=Newark; ComponentLink6URL: https://api.kemet.com/component-edge/download/datasheet/C0402C103K8RACTU.pdf?src-supplier=Digikey; ComponentLink6Description: https://api.kemet.com/component-edge/download/datasheet/C0402C103K8RACTU.pdf?src-supplier=Digikey; ComponentLink7URL: http://www.farnell.com/datasheets/2746035.pdf?src-supplier=Element14; ComponentLink7Description: http://www.farnell.com/datasheets/2746035.pdf?src-supplier=Element14; ComponentLink8URL: http://capacitoredge.kemet.com/capedge2/DataSheet?pn=C0402C103K8RACTU&src-supplier=Avnet; ComponentLink8Description: http://capacitoredge.kemet.com/capedge2/DataSheet?pn=C0402C103K8RACTU&src-supplier=Avnet; ComponentLink9URL: https://www.verical.com/server-webapp/html/getDatasheet?partID=74963&src-supplier=Verical; ComponentLink9Description: https://www.verical.com/server-webapp/html/getDatasheet?partID=74963&src-supplier=Verical; ComponentLink10URL: http://www.farnell.com/datasheets/2746035.pdf?src-supplier=Newark; ComponentLink10Description: http://www.farnell.com/datasheets/2746035.pdf?src-supplier=Newark; ComponentLink11URL: https://datasheet.octopart.com/C0402C103K8RACTU-Kemet-datasheet-21527579.pdf?src-supplier=Newark; ComponentLink11Description: https://datasheet.octopart.com/C0402C103K8RACTU-Kemet-datasheet-21527579.pdf?src-supplier=Newark; ComponentLink12URL: https://datasheet.octopart.com/C0402C103K8RACTU-Kemet-datasheet-65850003.pdf?src-supplier=Element14; ComponentLink12Description: https://datasheet.octopart.com/C0402C103K8RACTU-Kemet-datasheet-65850003.pdf?src-supplier=Element14; ComponentLink13URL: https://datasheet.octopart.com/C0402C103K8RACTU-KEMET-datasheet-149521620.pdf?src-supplier=Farnell; ComponentLink13Description: https://datasheet.octopart.com/C0402C103K8RACTU-KEMET-datasheet-149521620.pdf?src-supplier=Farnell; ComponentLink14URL: https://datasheet.octopart.com/C0402C103K8RACTU-KEMET-datasheet-157246124.pdf?src-supplier=Electro+Sonic; ComponentLink14Description: https://datasheet.octopart.com/C0402C103K8RACTU-KEMET-datasheet-157246124.pdf?src-supplier=Electro+Sonic; ComponentLink15URL: https://datasheet.octopart.com/C0402C103K8RACTU-KEMET-datasheet-140424561.pdf?src-supplier=TME; ComponentLink15Description: https://datasheet.octopart.com/C0402C103K8RACTU-KEMET-datasheet-140424561.pdf?src-supplier=TME; Supplier Part Number 1: 399-C0402C103K8RAC7867CT-ND
C167 C168 C176-C184 = CAP_4700pF_10V_0201: Multilayer Ceramic Capacitor, 4700 pF, 10 V, ± 10%, X5R, 0201 [0603 Metric]; Manufacturer: Murata; Dissipation Factor: 0.035%; Insulation Resistance: 10GR; Supplier 1: Digi-Key; Manufacturer Part Number: GRM033R61A472KA01D; RoHS: Yes; Category: Ceramic Capacitors; Stock 1: 417847; Pricing 1: 1=0.1, 10=0.01, 50=0.0054, 100=0.0042, 500=0.00318, 1000=0.0025, 2500=0.00227, 5000=0.00209 (USD); Mount: Surface Mount; Case Code (Metric): 0603; Case Code (Imperial): 0201; Min Operating Temperature: -55°C; Max Operating Temperature: 85°C; Package Quantity: 1; Tolerance: 10%; Packaging: Tape and Reel; Voltage Rating (DC): 10V; Dielectric: X5R; Termination: SMD/SMT; Series: GRM; Construction: Flat; Length: 0.6mm; Width: 0.012inch; Height: 0.3mm; Thickness: 0.013inch; Depth: 0.3mm; Radiation Hardening: No; Lead Free: Lead Free; RoHS Compliant: Yes; ComponentLink1URL: https://datasheet.ciiva.com/130/product-130016.pdf?src-supplier=Digi-Key; ComponentLink1Description: https://datasheet.ciiva.com/130/product-130016.pdf?src-supplier=Digi-Key; ComponentLink2URL: https://datasheet.ciiva.com/16206/product-16206957.pdf?src-supplier=Future+Electronics; ComponentLink2Description: https://datasheet.ciiva.com/16206/product-16206957.pdf?src-supplier=Future+Electronics; Supplier Part Number 1: 490-3164-1-ND
L9 = IND_FERRITE_BEADS_350mA_0201_BLM03AX241SN1D: Ferrite Beads Multi-Layer 240Ohm 25% 100MHz 350mA 380mOhm DCR 0201 Paper T/R; Manufacturer: Murata; Material: Steel; Number of Lines: 1; DC Resistance (DCR): 380mR; Supplier 1: Digi-Key; Manufacturer Part Number: BLM03AX241SN1D; RoHS: Yes; Category: Ferrite Beads and Chips; Stock 1: 129375; Pricing 1: 1=0.1, 10=0.026, 25=0.0232, 50=0.0212, 100=0.0191, 250=0.014, 500=0.01018, 1000=0.00997, 5000=0.00679 (USD); Number of Pins: 2; Case Code (Metric): 0603; Case Code (Imperial): 0201; Min Operating Temperature: -55°C; Max Operating Temperature: 125°C; Package Quantity: 1; Tolerance: 25%; Packaging: Tape and Reel; Current Rating: 350mA; Max Current Rating: 350mA; Max DC Current: 350mA; Termination: SMD/SMT; Test Frequency: 100MHz; Number of Circuits: 1; Series: BLM03AX; Length: 0.024inch; Width: 0.3mm; Height: 0.3mm; RoHS Compliant: Yes; ComponentLink1URL: https://datasheet.ciiva.com/41449/001172129-da-01-en-drossel-0201-240r-30-6x0-3mm-15000st-41449419.pdf?src-supplier=Conrad; ComponentLink1Description: https://datasheet.ciiva.com/41449/001172129-da-01-en-drossel-0201-240r-30-6x0-3mm-15000st-41449419.pdf?src-supplier=Conrad; ComponentLink2URL: https://datasheet.ciiva.com/1012/l0110e-1012684.pdf?src-supplier=Digi-Key; ComponentLink2Description: https://datasheet.ciiva.com/1012/l0110e-1012684.pdf?src-supplier=Digi-Key; ComponentLink3URL: https://datasheet.ciiva.com/1012/l0110e-1012683.pdf?src-supplier=Digi-Key; ComponentLink3Description: https://datasheet.ciiva.com/1012/l0110e-1012683.pdf?src-supplier=Digi-Key; ComponentLink4URL: https://datasheet.ciiva.com/1012/l0110e-1012685.pdf?src-supplier=Digi-Key; ComponentLink4Description: https://datasheet.ciiva.com/1012/l0110e-1012685.pdf?src-supplier=Digi-Key; Supplier Part Number 1: 490-5623-1-ND
L10 = IND_FERRITE_BEADS_120R_2A_0603_BLM18PG121SH1D: Ferrite Beads Multi-Layer 120Ohm 25% 100MHz 2A 50mOhm DCR 0603 Automotive Paper T/R; Manufacturer: Murata; Number of Lines: 1; Shielding: Unshielded; DC Resistance-Max: 50mR; Supplier 1: Digi-Key; Manufacturer Part Number: BLM18PG121SH1D; RoHS: Yes; Category: Ferrite Beads and Chips; Stock 1: 282143; Pricing 1: 1=0.11, 10=0.086, 25=0.0772, 50=0.0566, 100=0.0489, 250=0.03864, 500=0.03262, 1000=0.02747 (USD); Mount: Surface Mount; Case Code (Metric): 1608; Case Code (Imperial): 0603; Weight: 7.1E-05oz; Contact Plating: Tin,Matte; Material: Ferrite; Min Operating Temperature: -55°C; Max Operating Temperature: 125°C; Tolerance: 25%; Packaging: Tape and Reel; Package Quantity: 1; Current Rating: 2A; Max Current Rating: 2A; Termination: SMD/SMT; Max DC Current: 2A; Test Frequency: 100MHz; Number of Circuits: 1; Series: EMIFIL®, BLM18P; Length: 1.6mm; Width: 0.031inch; Height: 0.8mm; Depth: 0.8mm; Ratings: AEC-Q200; Lead Free: Lead Free; RoHS Compliant: Yes; ComponentLink1URL: https://datasheet.octopart.com/BLM18PG121SH1D-Murata-datasheet-141273661.pdf?src-supplier=Element14; ComponentLink1Description: https://datasheet.octopart.com/BLM18PG121SH1D-Murata-datasheet-141273661.pdf?src-supplier=Element14; ComponentLink2URL: https://datasheet.octopart.com/BLM18PG121SH1D-Murata-datasheet-62086335.pdf?src-supplier=Future+Electronics; ComponentLink2Description: https://datasheet.octopart.com/BLM18PG121SH1D-Murata-datasheet-62086335.pdf?src-supplier=Future+Electronics; ComponentLink3URL: http://search.murata.co.jp/Ceramy/image/img/PDF/ENG/L0132S0193BLM18P.pdf?src-supplier=Avnet; ComponentLink3Description: http://search.murata.co.jp/Ceramy/image/img/PDF/ENG/L0132S0193BLM18P.pdf?src-supplier=Avnet; ComponentLink4URL: https://www.murata.com/en-us/products/productdata/8796738650142/ENFA0003.pdf?src-supplier=Digi-Key; ComponentLink4Description: https://www.murata.com/en-us/products/productdata/8796738650142/ENFA0003.pdf?src-supplier=Digi-Key; Supplier Part Number 1: 490-7815-6-ND
R41-R52 = RES_0R_5%_100mW_0402: SMD Chip Resistor, Jumper, 0 ohm, 100 mW, 0402 [1005 Metric], Thick Film, General Purpose; Manufacturer: Panasonic; Power Rating: 100mW; Voltage Rating: 50V; Temperature Coefficient: 600ppm/°C; Supplier 1: Mouser; Manufacturer Part Number: ERJ-2GE0R00X; RoHS: Yes; Category: Chip SMD Resistors; Stock 1: 10989354; Pricing 1: 1=0.1, 10=0.013, 50=0.013, 100=0.006, 1000=0.004, 2500=0.003, 10000=0.003 (USD); Mount: Surface Mount; Case/Package: 0402; Contact Plating: Tin; Case Code (Metric): 1005; Size Code: 0402; Min Operating Temperature: -55°C; Max Operating Temperature: 155°C; Resistor Type: Thick Film; Packaging: Cut Tape; Package Quantity: 10000; Number of Terminations: 2; Termination: SMD/SMT; Max Power Dissipation: 100mW; Voltage Rating (DC): 50V; Features: Automotive AEC-Q200; Series: ERJ; Construction: Rectangular; Technology: THICK FILM; Length: 1mm; Width: 0.5mm; Height: 0.35mm; Depth: 0.5mm; Ratings: AEC-Q200; Radiation Hardening: No; Reach SVHC Compliant: No; Military Standard: Not; Lead Free: Lead Free; RoHS Compliant: Yes; ComponentLink1URL: https://datasheet.ciiva.com/11821/0900766b80f806dd-11821176.pdf?src-supplier=Rs; ComponentLink1Description: https://datasheet.ciiva.com/11821/0900766b80f806dd-11821176.pdf?src-supplier=Rs; ComponentLink2URL: https://datasheet.ciiva.com/43460/1678796-43460347.pdf?src-supplier=Farnell; ComponentLink2Description: https://datasheet.ciiva.com/43460/1678796-43460347.pdf?src-supplier=Farnell; ComponentLink3URL: https://datasheet.ciiva.com/46389/1678796-46389518.pdf?src-supplier=Element14; ComponentLink3Description: https://datasheet.ciiva.com/46389/1678796-46389518.pdf?src-supplier=Element14; ComponentLink4URL: https://datasheet.ciiva.com/5959/1678796-5959692.pdf?src-supplier=Farnell; ComponentLink4Description: https://datasheet.ciiva.com/5959/1678796-5959692.pdf?src-supplier=Farnell; ComponentLink5URL: https://datasheet.ciiva.com/28695/1678796-28695758.pdf?src-supplier=Element14; ComponentLink5Description: https://datasheet.ciiva.com/28695/1678796-28695758.pdf?src-supplier=Element14; ComponentLink6URL: https://datasheet.ciiva.com/16783/70260739-16783734.pdf?src-supplier=Allied+Electronics; ComponentLink6Description: https://datasheet.ciiva.com/16783/70260739-16783734.pdf?src-supplier=Allied+Electronics; ComponentLink7URL: https://datasheet.ciiva.com/16778/70260739-16778335.pdf?src-supplier=Allied+Electronics; ComponentLink7Description: https://datasheet.ciiva.com/16778/70260739-16778335.pdf?src-supplier=Allied+Electronics; ComponentLink8URL: https://datasheet.ciiva.com/48531/aoa0000ce1-48531077.pdf?src-supplier=Avnet; ComponentLink8Description: https://datasheet.ciiva.com/48531/aoa0000ce1-48531077.pdf?src-supplier=Avnet; ComponentLink9URL: https://datasheet.ciiva.com/30097/4aoa0000ce1-30097116.pdf?src-supplier=Onlinecomponents.com; ComponentLink9Description: https://datasheet.ciiva.com/30097/4aoa0000ce1-30097116.pdf?src-supplier=Onlinecomponents.com; Supplier Part Number 1: 667-ERJ-2GE0R00X
U7 = IC_MPU_ARM_1.5GHZ_MIMX8MD6DVAJZAB: i.MX 8M: Cortex-A53 up to 1.5GHz and Cortex-M4 / TRAY TRAY MULTIPLE DP BAKEABLE RoHS Compliant: Yes; Manufacturer: NXP Semiconductors; Supplier 1: Digikey; Manufacturer Part Number: MIMX8MD6DVAJZAB; RoHS: Yes; Category: Microprocessors; Stock 1: 162; Pricing 1: 1=56.07, 10=46.184, 25=43.716, 90=41.175 (USD); RoHS Compliant: Yes; Supplier Part Number 1: 568-14717-ND